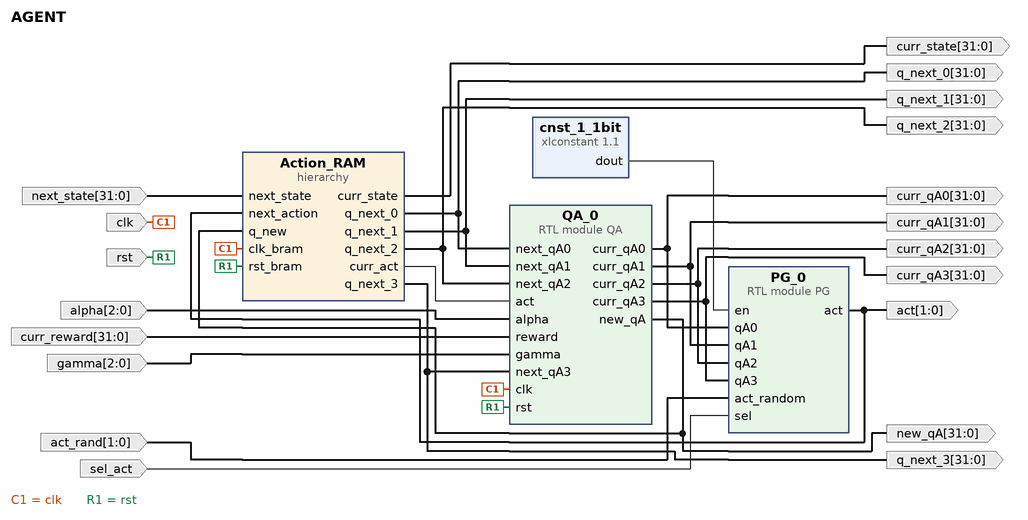
[diagram p0: block diagram of the top level]
# Vivado block design AGENT, xc7z020clg400-1, Vivado 2021.1
create_bd_design AGENT

create_bd_port -dir I -type clk clk
create_bd_port -dir I -type rst rst
create_bd_port -dir I -from 31 -to 0 next_state
create_bd_port -dir I -from 31 -to 0 curr_reward
create_bd_port -dir I -from 2 -to 0 gamma
create_bd_port -dir I -from 2 -to 0 alpha
create_bd_port -dir O -from 31 -to 0 new_qA
create_bd_port -dir O -from 31 -to 0 q_next_0
create_bd_port -dir O -from 31 -to 0 q_next_1
create_bd_port -dir O -from 31 -to 0 q_next_2
create_bd_port -dir O -from 31 -to 0 q_next_3
create_bd_port -dir I sel_act
create_bd_port -dir I -from 1 -to 0 act_rand
create_bd_port -dir O -from 1 -to 0 act
create_bd_port -dir O -from 31 -to 0 curr_qA0
create_bd_port -dir O -from 31 -to 0 curr_qA1
create_bd_port -dir O -from 31 -to 0 curr_qA2
create_bd_port -dir O -from 31 -to 0 curr_qA3
create_bd_port -dir O -from 31 -to 0 curr_state

create_bd_cell -type ip -vlnv xilinx.com:ip:xlconstant:1.1 cnst_1_1bit
create_bd_cell -type hier Action_RAM
create_bd_cell -type module -reference QA QA_0
create_bd_cell -type module -reference PG PG_0

# ---- hierarchy /Action_RAM ----
current_bd_instance /Action_RAM
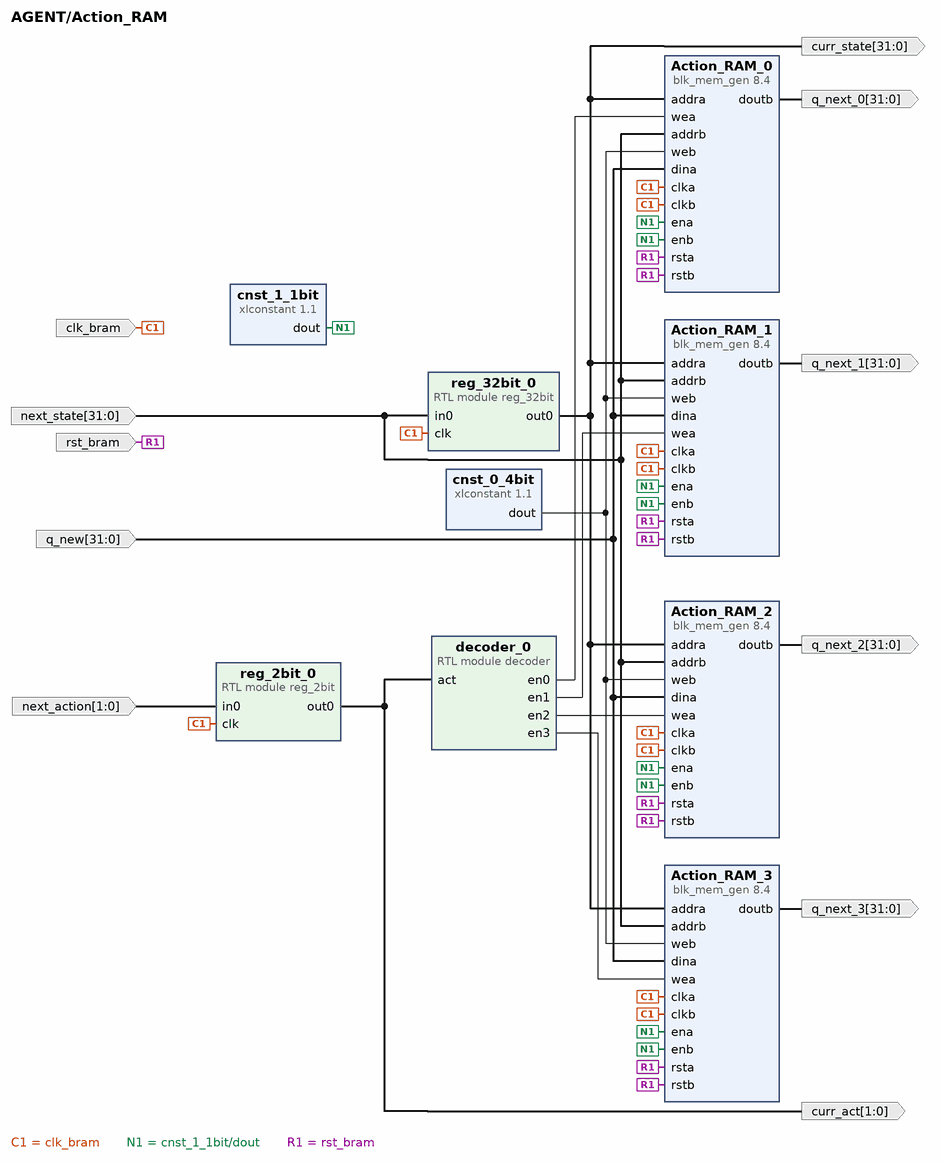
[diagram p1: block diagram inside /Action_RAM]
create_bd_pin -dir I -type clk clk_bram
create_bd_pin -dir I -type rst rst_bram
create_bd_pin -dir I -from 31 -to 0 q_new
create_bd_pin -dir I -from 31 -to 0 next_state
create_bd_pin -dir O -from 31 -to 0 q_next_0
create_bd_pin -dir I -from 1 -to 0 next_action
create_bd_pin -dir O -from 31 -to 0 q_next_2
create_bd_pin -dir O -from 31 -to 0 q_next_3
create_bd_pin -dir O -from 31 -to 0 q_next_1
create_bd_pin -dir O -from 1 -to 0 curr_act
create_bd_pin -dir O -from 31 -to 0 curr_state

create_bd_cell -type ip -vlnv xilinx.com:ip:blk_mem_gen:8.4 Action_RAM_0
set_property -dict [list \
  CONFIG.EN_SAFETY_CKT true \
  CONFIG.Enable_32bit_Address true \
  CONFIG.Enable_B Use_ENB_Pin \
  CONFIG.Memory_Type True_Dual_Port_RAM \
  CONFIG.Port_B_Clock 100 \
  CONFIG.Port_B_Enable_Rate 100 \
  CONFIG.Port_B_Write_Rate 50 \
  CONFIG.Read_Width_A 32 \
  CONFIG.Read_Width_B 32 \
  CONFIG.Register_PortA_Output_of_Memory_Primitives false \
  CONFIG.Register_PortB_Output_of_Memory_Primitives false \
  CONFIG.Use_RSTA_Pin true \
  CONFIG.Use_RSTB_Pin true \
  CONFIG.Write_Width_A 32 \
  CONFIG.Write_Width_B 32 \
  CONFIG.use_bram_block Stand_Alone \
] [get_bd_cells Action_RAM_0]
create_bd_cell -type ip -vlnv xilinx.com:ip:xlconstant:1.1 cnst_0_4bit
set_property -dict {CONFIG.CONST_VAL 0 CONFIG.CONST_WIDTH 4} [get_bd_cells cnst_0_4bit]
create_bd_cell -type ip -vlnv xilinx.com:ip:blk_mem_gen:8.4 Action_RAM_2
set_property -dict [list \
  CONFIG.EN_SAFETY_CKT true \
  CONFIG.Enable_32bit_Address true \
  CONFIG.Enable_B Use_ENB_Pin \
  CONFIG.Memory_Type True_Dual_Port_RAM \
  CONFIG.Port_B_Clock 100 \
  CONFIG.Port_B_Enable_Rate 100 \
  CONFIG.Port_B_Write_Rate 50 \
  CONFIG.Read_Width_A 32 \
  CONFIG.Read_Width_B 32 \
  CONFIG.Register_PortA_Output_of_Memory_Primitives false \
  CONFIG.Register_PortB_Output_of_Memory_Primitives false \
  CONFIG.Use_RSTA_Pin true \
  CONFIG.Use_RSTB_Pin true \
  CONFIG.Write_Width_A 32 \
  CONFIG.Write_Width_B 32 \
  CONFIG.use_bram_block Stand_Alone \
] [get_bd_cells Action_RAM_2]
create_bd_cell -type ip -vlnv xilinx.com:ip:blk_mem_gen:8.4 Action_RAM_3
set_property -dict [list \
  CONFIG.EN_SAFETY_CKT true \
  CONFIG.Enable_32bit_Address true \
  CONFIG.Enable_B Use_ENB_Pin \
  CONFIG.Memory_Type True_Dual_Port_RAM \
  CONFIG.Port_B_Clock 100 \
  CONFIG.Port_B_Enable_Rate 100 \
  CONFIG.Port_B_Write_Rate 50 \
  CONFIG.Read_Width_A 32 \
  CONFIG.Read_Width_B 32 \
  CONFIG.Register_PortA_Output_of_Memory_Primitives false \
  CONFIG.Register_PortB_Output_of_Memory_Primitives false \
  CONFIG.Use_RSTA_Pin true \
  CONFIG.Use_RSTB_Pin true \
  CONFIG.Write_Width_A 32 \
  CONFIG.Write_Width_B 32 \
  CONFIG.use_bram_block Stand_Alone \
] [get_bd_cells Action_RAM_3]
create_bd_cell -type ip -vlnv xilinx.com:ip:xlconstant:1.1 cnst_1_1bit
create_bd_cell -type ip -vlnv xilinx.com:ip:blk_mem_gen:8.4 Action_RAM_1
set_property -dict [list \
  CONFIG.EN_SAFETY_CKT true \
  CONFIG.Enable_32bit_Address true \
  CONFIG.Enable_B Use_ENB_Pin \
  CONFIG.Memory_Type True_Dual_Port_RAM \
  CONFIG.Port_B_Clock 100 \
  CONFIG.Port_B_Enable_Rate 100 \
  CONFIG.Port_B_Write_Rate 50 \
  CONFIG.Read_Width_A 32 \
  CONFIG.Read_Width_B 32 \
  CONFIG.Register_PortA_Output_of_Memory_Primitives false \
  CONFIG.Register_PortB_Output_of_Memory_Primitives false \
  CONFIG.Use_RSTA_Pin true \
  CONFIG.Use_RSTB_Pin true \
  CONFIG.Write_Width_A 32 \
  CONFIG.Write_Width_B 32 \
  CONFIG.use_bram_block Stand_Alone \
] [get_bd_cells Action_RAM_1]
create_bd_cell -type module -reference reg_2bit reg_2bit_0
create_bd_cell -type module -reference reg_32bit reg_32bit_0
create_bd_cell -type module -reference decoder decoder_0

# ---- connections ----

current_bd_instance /Action_RAM
connect_bd_net [get_bd_pins Action_RAM_0/doutb] [get_bd_pins q_next_0]
connect_bd_net [get_bd_pins Action_RAM_1/doutb] [get_bd_pins q_next_1]
connect_bd_net [get_bd_pins Action_RAM_2/doutb] [get_bd_pins q_next_2]
connect_bd_net [get_bd_pins Action_RAM_3/doutb] [get_bd_pins q_next_3]
connect_bd_net -net clk_0_1 [get_bd_pins clk_bram] \
  [get_bd_pins Action_RAM_0/clkb] [get_bd_pins Action_RAM_3/clka] [get_bd_pins Action_RAM_3/clkb] \
  [get_bd_pins Action_RAM_2/clka] [get_bd_pins Action_RAM_2/clkb] [get_bd_pins Action_RAM_1/clka] \
  [get_bd_pins Action_RAM_1/clkb] [get_bd_pins Action_RAM_0/clka] [get_bd_pins reg_2bit_0/clk] [get_bd_pins reg_32bit_0/clk]
connect_bd_net [get_bd_pins cnst_0_4bit/dout] \
  [get_bd_pins Action_RAM_0/web] [get_bd_pins Action_RAM_3/web] [get_bd_pins Action_RAM_2/web] [get_bd_pins Action_RAM_1/web]
connect_bd_net [get_bd_pins cnst_1_1bit/dout] \
  [get_bd_pins Action_RAM_0/ena] [get_bd_pins Action_RAM_0/enb] [get_bd_pins Action_RAM_3/ena] [get_bd_pins Action_RAM_3/enb] \
  [get_bd_pins Action_RAM_2/ena] [get_bd_pins Action_RAM_2/enb] [get_bd_pins Action_RAM_1/ena] [get_bd_pins Action_RAM_1/enb]
connect_bd_net [get_bd_pins decoder_0/en0] [get_bd_pins Action_RAM_0/wea]
connect_bd_net [get_bd_pins decoder_0/en1] [get_bd_pins Action_RAM_1/wea]
connect_bd_net [get_bd_pins decoder_0/en2] [get_bd_pins Action_RAM_2/wea]
connect_bd_net [get_bd_pins decoder_0/en3] [get_bd_pins Action_RAM_3/wea]
connect_bd_net -net dina_0_1 [get_bd_pins q_new] \
  [get_bd_pins Action_RAM_1/dina] [get_bd_pins Action_RAM_2/dina] [get_bd_pins Action_RAM_3/dina] \
  [get_bd_pins Action_RAM_0/dina]
connect_bd_net -net in0_0_1 [get_bd_pins next_action] [get_bd_pins reg_2bit_0/in0]
connect_bd_net [get_bd_pins next_state] \
  [get_bd_pins Action_RAM_1/addrb] [get_bd_pins Action_RAM_2/addrb] [get_bd_pins Action_RAM_3/addrb] \
  [get_bd_pins Action_RAM_0/addrb] [get_bd_pins reg_32bit_0/in0]
connect_bd_net [get_bd_pins reg_2bit_0/out0] [get_bd_pins curr_act] [get_bd_pins decoder_0/act]
connect_bd_net [get_bd_pins reg_32bit_0/out0] \
  [get_bd_pins Action_RAM_0/addra] [get_bd_pins Action_RAM_1/addra] [get_bd_pins Action_RAM_2/addra] \
  [get_bd_pins Action_RAM_3/addra] [get_bd_pins curr_state]
connect_bd_net -net rsta_0_1 [get_bd_pins rst_bram] \
  [get_bd_pins Action_RAM_0/rstb] [get_bd_pins Action_RAM_3/rsta] [get_bd_pins Action_RAM_3/rstb] \
  [get_bd_pins Action_RAM_2/rsta] [get_bd_pins Action_RAM_2/rstb] [get_bd_pins Action_RAM_1/rsta] \
  [get_bd_pins Action_RAM_1/rstb] [get_bd_pins Action_RAM_0/rsta]

current_bd_instance /
connect_bd_net [get_bd_pins Action_RAM/curr_act] [get_bd_pins QA_0/act]
connect_bd_net [get_bd_pins Action_RAM/curr_state] [get_bd_ports curr_state]
connect_bd_net [get_bd_pins Action_RAM/q_next_0] [get_bd_ports q_next_0] [get_bd_pins QA_0/next_qA0]
connect_bd_net [get_bd_pins Action_RAM/q_next_1] [get_bd_ports q_next_1] [get_bd_pins QA_0/next_qA1]
connect_bd_net [get_bd_pins Action_RAM/q_next_2] [get_bd_ports q_next_2] [get_bd_pins QA_0/next_qA2]
connect_bd_net [get_bd_pins Action_RAM/q_next_3] [get_bd_ports q_next_3] [get_bd_pins QA_0/next_qA3]
connect_bd_net [get_bd_pins PG_0/act] [get_bd_pins Action_RAM/next_action] [get_bd_ports act]
connect_bd_net [get_bd_pins QA_0/curr_qA0] [get_bd_ports curr_qA0] [get_bd_pins PG_0/qA0]
connect_bd_net [get_bd_pins QA_0/curr_qA1] [get_bd_ports curr_qA1] [get_bd_pins PG_0/qA1]
connect_bd_net [get_bd_pins QA_0/curr_qA2] [get_bd_ports curr_qA2] [get_bd_pins PG_0/qA2]
connect_bd_net [get_bd_pins QA_0/curr_qA3] [get_bd_ports curr_qA3] [get_bd_pins PG_0/qA3]
connect_bd_net [get_bd_pins QA_0/new_qA] [get_bd_pins Action_RAM/q_new] [get_bd_ports new_qA]
connect_bd_net -net act_random_0_1 [get_bd_ports act_rand] [get_bd_pins PG_0/act_random]
connect_bd_net [get_bd_ports alpha] [get_bd_pins QA_0/alpha]
connect_bd_net [get_bd_ports clk] [get_bd_pins Action_RAM/clk_bram] [get_bd_pins QA_0/clk]
connect_bd_net [get_bd_ports curr_reward] [get_bd_pins QA_0/reward]
connect_bd_net [get_bd_ports gamma] [get_bd_pins QA_0/gamma]
connect_bd_net [get_bd_ports next_state] [get_bd_pins Action_RAM/next_state]
connect_bd_net -net rst_bram_1 [get_bd_ports rst] [get_bd_pins Action_RAM/rst_bram] [get_bd_pins QA_0/rst]
connect_bd_net -net sel_0_1 [get_bd_ports sel_act] [get_bd_pins PG_0/sel]
connect_bd_net -net xlconstant_0_dout [get_bd_pins cnst_1_1bit/dout] [get_bd_pins PG_0/en]

validate_bd_design
save_bd_design
